# Altium schematic sheet ScrollWheel.SchDoc
size Letter; CompanyName: Ploopy Corporation; Organization: Ploopy Corporation; Address1: 137-1140 Burnhamthorpe Road W; Address2: Mississauga; Address3: Ontario; Address4: Canada L5C 0A3; DocumentNumber: 1; Revision: R1.001; SheetNumber: 1; SheetTotal: 7
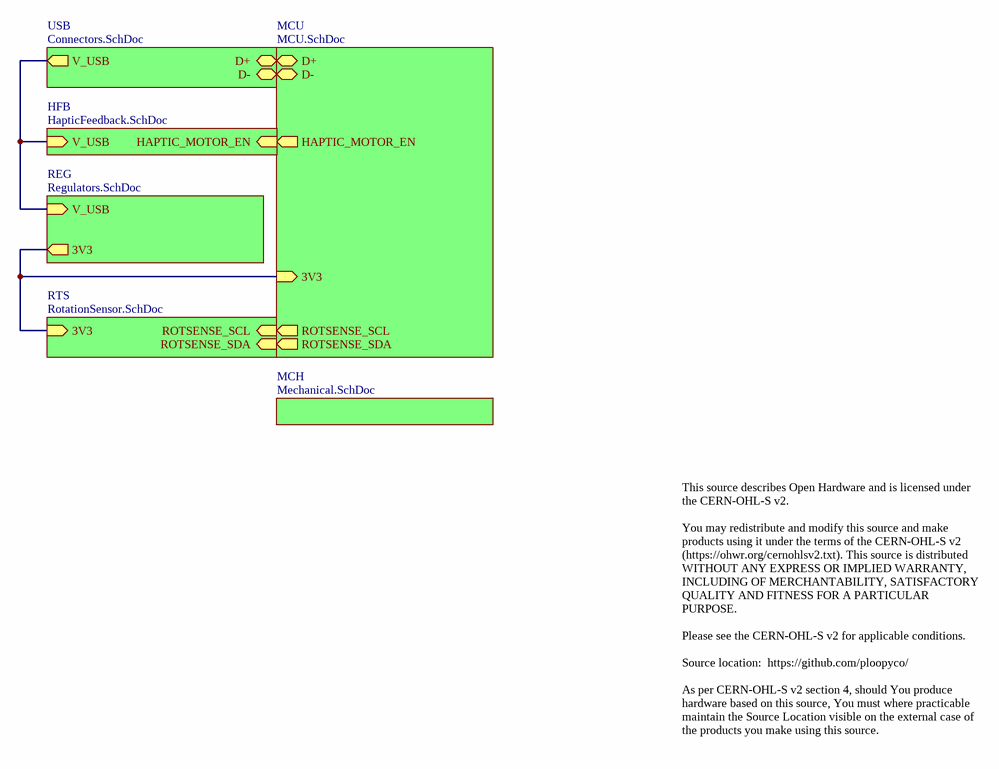
[diagram p0: ScrollWheel.SchDoc]

## Sub-sheets
HFB = HapticFeedback.SchDoc: V_USB (in), HAPTIC_MOTOR_EN (in)
MCH = Mechanical.SchDoc: no entries
MCU = MCU.SchDoc: D+ (bidir), D- (bidir), 3V3 (in), ROTSENSE_SDA (out), ROTSENSE_SCL (out), HAPTIC_MOTOR_EN (out)
REG = Regulators.SchDoc: 3V3 (out), V_USB (in)
RTS = RotationSensor.SchDoc: 3V3 (in), ROTSENSE_SCL (in), ROTSENSE_SDA (in)
USB = Connectors.SchDoc: D+ (bidir), V_USB (out), D- (bidir)

## Nets
(unnamed): sheet USB/D+, sheet MCU/D+
(unnamed): sheet USB/V_USB, sheet REG/V_USB, sheet HFB/V_USB
(unnamed): sheet USB/D-, sheet MCU/D-
(unnamed): sheet REG/3V3, sheet RTS/3V3, sheet MCU/3V3
(unnamed): sheet RTS/ROTSENSE_SCL, sheet MCU/ROTSENSE_SCL
(unnamed): sheet RTS/ROTSENSE_SDA, sheet MCU/ROTSENSE_SDA
(unnamed): sheet MCU/HAPTIC_MOTOR_EN, sheet HFB/HAPTIC_MOTOR_EN

## Notes on the sheet
- This source describes Open Hardware and is licensed under the CERN-OHL-S v2.
  You may redistribute and modify this source and make products using it under the terms of the CERN-OHL-S v2 (https://ohwr.org/cernohlsv2.txt). This source is distributed WITHOUT ANY EXPRESS OR IMPLIED WARRANTY, INCLUDING OF MERCHANTABILITY, SATISFACTORY QUALITY AND FITNESS FOR A PARTICULAR PURPOSE.
  Please see the CERN-OHL-S v2 for applicable conditions.
  Source location:  https://github.com/ploopyco/
  As per CERN-OHL-S v2 section 4, should You produce hardware based on this source, You must where practicable maintain the Source Location visible on the external case of the products you make using this source.
- Copyright Ploopy Corporation
- Licensed under the CERN-OHL-S v2
- http://ohwr.org/cernohl
- Title:
- PCB:
- Version:
- Ploopy Corporation
- Mississauga ON L5C 0A3
- 137-1140 Burnhamthorpe Road W
- Date:
- Time:
- Sheet
- of
- Canada